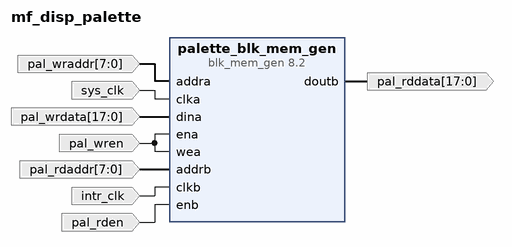
[diagram p0: block diagram of the top level]
# Vivado block design mf_disp_palette, Vivado 2014.4
create_bd_design mf_disp_palette

create_bd_port -dir I -from 7 -to 0 pal_wraddr
create_bd_port -dir I sys_clk
create_bd_port -dir I -from 17 -to 0 pal_wrdata
create_bd_port -dir I pal_wren
create_bd_port -dir I -from 7 -to 0 pal_rdaddr
create_bd_port -dir I intr_clk
create_bd_port -dir I pal_rden
create_bd_port -dir O -from 17 -to 0 pal_rddata

create_bd_cell -type ip -vlnv xilinx.com:ip:blk_mem_gen:8.2 palette_blk_mem_gen
set_property -dict [list \
  CONFIG.Memory_Type Simple_Dual_Port_RAM \
  CONFIG.Enable_32bit_Address false \
  CONFIG.Use_Byte_Write_Enable false \
  CONFIG.Write_Width_A 18 \
  CONFIG.Write_Depth_A 256 \
  CONFIG.Operating_Mode_A NO_CHANGE \
  CONFIG.Write_Width_B 18 \
  CONFIG.Read_Width_B 18 \
  CONFIG.Enable_B Use_ENB_Pin \
  CONFIG.Register_PortB_Output_of_Memory_Primitives true \
  CONFIG.Port_B_Clock 100 \
  CONFIG.Port_B_Enable_Rate 100 \
  CONFIG.use_bram_block Stand_Alone \
] [get_bd_cells palette_blk_mem_gen]

# ---- connections ----

connect_bd_net [get_bd_ports pal_wraddr] [get_bd_pins palette_blk_mem_gen/addra]
connect_bd_net [get_bd_ports sys_clk] [get_bd_pins palette_blk_mem_gen/clka]
connect_bd_net [get_bd_ports pal_wrdata] [get_bd_pins palette_blk_mem_gen/dina]
connect_bd_net [get_bd_ports pal_wren] [get_bd_pins palette_blk_mem_gen/ena] [get_bd_pins palette_blk_mem_gen/wea]
connect_bd_net [get_bd_ports pal_rdaddr] [get_bd_pins palette_blk_mem_gen/addrb]
connect_bd_net [get_bd_ports intr_clk] [get_bd_pins palette_blk_mem_gen/clkb]
connect_bd_net [get_bd_ports pal_rden] [get_bd_pins palette_blk_mem_gen/enb]
connect_bd_net [get_bd_pins palette_blk_mem_gen/doutb] [get_bd_ports pal_rddata]

validate_bd_design
save_bd_design
